# Altium schematic sheet OPTO_PRESSURE.SchDoc: Title
size A3; Date: *******; ApprovedBy: *******; CheckedBy: None; Author: *******; CompanyName: *******; DrawnBy: Name; Engineer: *******; Organization: *******; Address1: *******; Address2: *******; Address3: *******; Address4: *******; DocumentNumber: Doc Num; Revision: *******; SheetNumber: 1; SheetTotal: *******; CurrentTime: *******; CurrentDate: *******; Time: *******; DocumentFullPathAndName: *******; DocumentName: *******; ModifiedDate: *******; ImagePath: *******; ProjectName: *******; Application_BuildNumber: *******
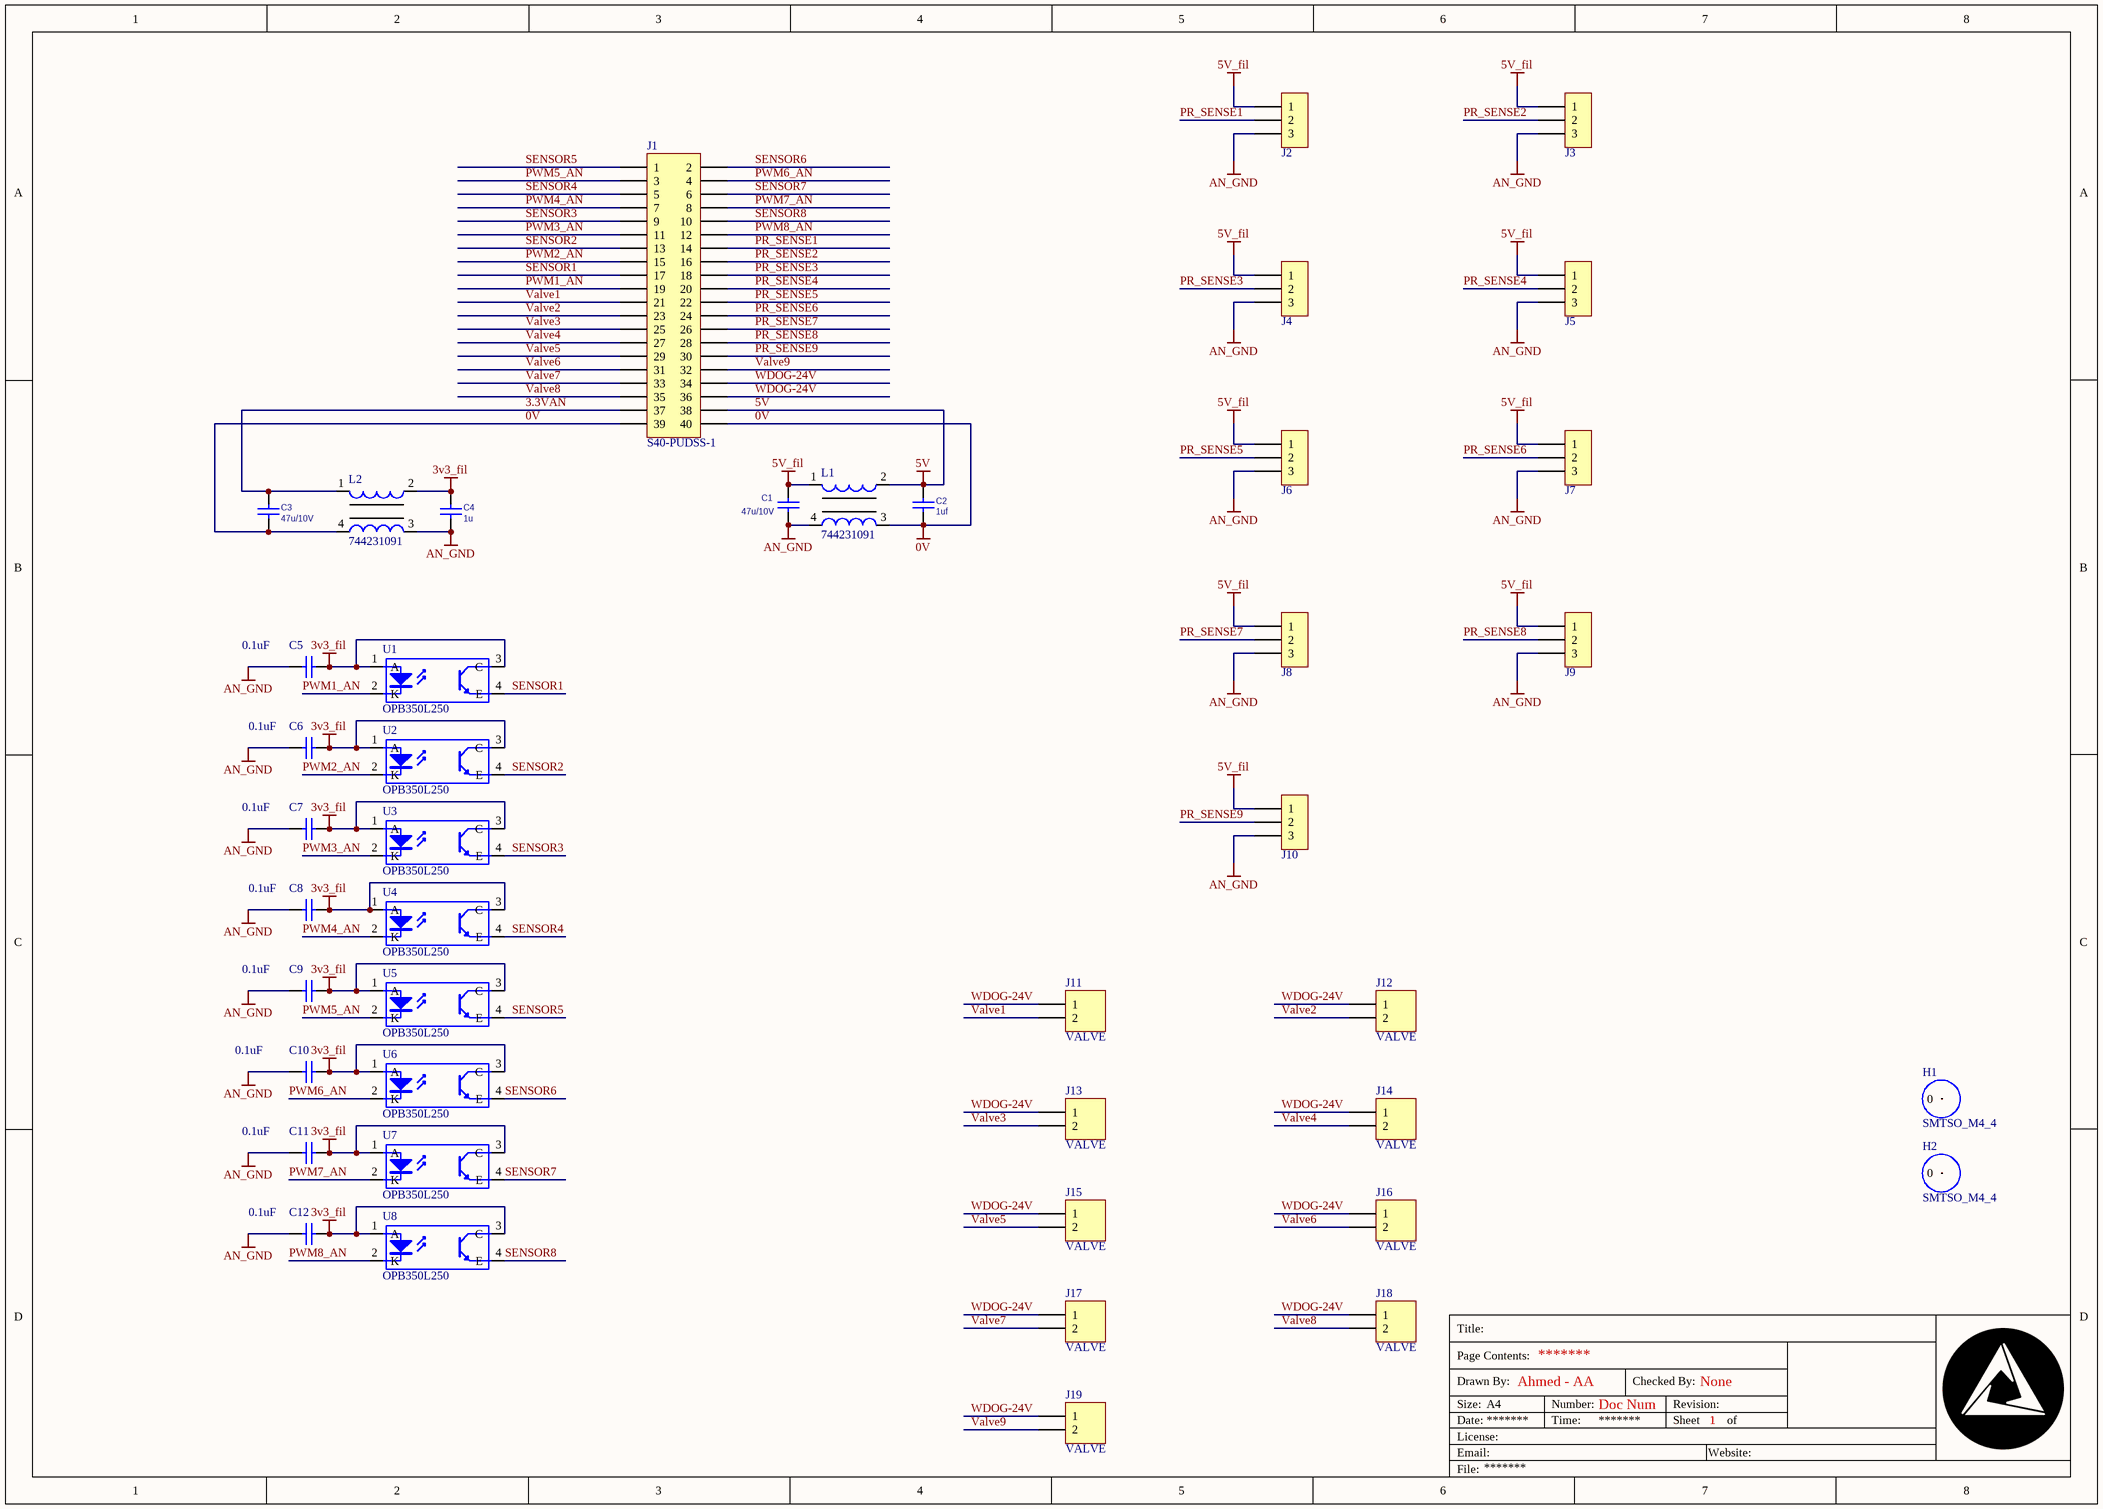
[diagram p0: OPTO_PRESSURE.SchDoc]

## Parts
C1  47u/10V  [CAPC2012X13N(0805)]
C2  1uf  [CAPC1608X09N(0603)]
C3  47u/10V  [CAPC2012X13N(0805)]
C4  1u  [CAPC1608X09N(0603)]
C5  value 0.1uF  [1608[0603]]  (hidden comment: Cap Semi)
C6  value 0.1uF  [1608[0603]]  (hidden comment: Cap Semi)
C7  value 0.1uF  [1608[0603]]  (hidden comment: Cap Semi)
C8  value 0.1uF  [1608[0603]]  (hidden comment: Cap Semi)
C9  value 0.1uF  [1608[0603]]  (hidden comment: Cap Semi)
C10  value 0.1uF  [1608[0603]]  (hidden comment: Cap Semi)
C11  value 0.1uF  [1608[0603]]  (hidden comment: Cap Semi)
C12  value 0.1uF  [1608[0603]]  (hidden comment: Cap Semi)
H1  SMTSO_M4_4  [SMTSO_M4_4]
H2  SMTSO_M4_4  [SMTSO_M4_4]
J1  S40-PUDSS-1  [S40B-PUDSS-1]
J2  CON3  [XA3]  (value not drawn)
J3  CON3  [XA3]  (value not drawn)
J4  CON3  [XA3]  (value not drawn)
J5  CON3  [XA3]  (value not drawn)
J6  CON3  [XA3]  (value not drawn)
J7  CON3  [XA3]  (value not drawn)
J8  CON3  [XA3]  (value not drawn)
J9  CON3  [XA3]  (value not drawn)
J10  CON3  [XA3]  (value not drawn)
J11  VALVE  [XA2]
J12  VALVE  [XA2]
J13  VALVE  [XA2]
J14  VALVE  [XA2]
J15  VALVE  [XA2]
J16  VALVE  [XA2]
J17  VALVE  [XA2]
J18  VALVE  [XA2]
J19  VALVE  [XA2]
L1  744231091  [WE-CNSW-0805]
L2  744231091  [WE-CNSW-0805]
U1  OPB350L250  [OPB350L250]
U2  OPB350L250  [OPB350L250]
U3  OPB350L250  [OPB350L250]
U4  OPB350L250  [OPB350L250]
U5  OPB350L250  [OPB350L250]
U6  OPB350L250  [OPB350L250]
U7  OPB350L250  [OPB350L250]
U8  OPB350L250  [OPB350L250]

## Nets
0V: C2.1 C3.1 J1.39 J1.40 L1.3 L2.4
3v3_fil: C4.2 C5.1 C6.1 C7.1 C8.1 C9.1 C10.1 C11.1 C12.1 L2.2 U1.1(A) U1.3(C) U2.1(A) U2.3(C) U3.1(A) U3.3(C) U4.1(A) U4.3(C) U5.1(A) U5.3(C) U6.1(A) U6.3(C) U7.1(A) U7.3(C) U8.1(A) U8.3(C)
5V: C2.2 J1.38 L1.2
5V_fil: C1.2 J2.1 J3.1 J4.1 J5.1 J6.1 J7.1 J8.1 J9.1 J10.1 L1.1
AN_GND: C1.1 C4.1 C5.2 C6.2 C7.2 C8.2 C9.2 C10.2 C11.2 C12.2 J2.3 J3.3 J4.3 J5.3 J6.3 J7.3 J8.3 J9.3 J10.3 L1.4 L2.3
3.3VAN: C3.2 J1.37 L2.1
PR_SENSE1: J1.14 J2.2
PR_SENSE2: J1.16 J3.2
PR_SENSE3: J1.18 J4.2
PR_SENSE4: J1.20 J5.2
PR_SENSE5: J1.22 J6.2
PR_SENSE6: J1.24 J7.2
PR_SENSE7: J1.26 J8.2
PR_SENSE8: J1.28 J9.2
PR_SENSE9: J1.30 J10.2
PWM1_AN: J1.19 U1.2(K)
PWM2_AN: J1.15 U2.2(K)
PWM3_AN: J1.11 U3.2(K)
PWM4_AN: J1.7 U4.2(K)
PWM5_AN: J1.3 U5.2(K)
PWM6_AN: J1.4 U6.2(K)
PWM7_AN: J1.8 U7.2(K)
PWM8_AN: J1.12 U8.2(K)
SENSOR1: J1.17 U1.4(E)
SENSOR2: J1.13 U2.4(E)
SENSOR3: J1.9 U3.4(E)
SENSOR4: J1.5 U4.4(E)
SENSOR5: J1.1 U5.4(E)
SENSOR6: J1.2 U6.4(E)
SENSOR7: J1.6 U7.4(E)
SENSOR8: J1.10 U8.4(E)
Valve1: J1.21 J11.2
Valve2: J1.23 J12.2
Valve3: J1.25 J13.2
Valve4: J1.27 J14.2
Valve5: J1.29 J15.2
Valve6: J1.31 J16.2
Valve7: J1.33 J17.2
Valve8: J1.35 J18.2
Valve9: J1.32 J19.2
WDOG-24V: J1.34 J1.36 J11.1 J12.1 J13.1 J14.1 J15.1 J16.1 J17.1 J18.1 J19.1

Not connected (* = marked no-connect by the designer): H1 ?1(0); H2 ?1(0)

## Notes on the sheet
- Title:
- Drawn By:
- Page Contents:
- Ahmed - AA
- Checked By:
- Size:
- Date:
- File:
- License:
- Email:
- A4
- Number:
- Time:
- Revision:
- Sheet
- Website:
- of

## Library data of the parts
C1 C3 = C2012X5R1A476M125AC: Capacitor, Ceramic, 10V, ±20%, X5R, -55°C to 85°C; 08 Manufacturer: TDK; 04 Value: 47u; 06 Package: 0805; 05 Footprint Type: SMD; 02 Part Number: C2012X5R1A476M125AC; 03 Description: Capacitor, Ceramic, 10V, ±20%, X5R, -55°C to 85°C; 01 Part Category: Capacitor; 09 Digikey PN: 445-8239-2-ND; ComponentLink1Description: Datasheet; ComponentLink1URL: L:\Datasheet\Capacitor\mlcc_commercial_general_en.pdf
C2 = GRM188R71E105KA12D: Capacitor, Ceramic, 25V, ±10%, X7R, -55°C to 125°C; 08 Manufacturer: Murata Electronics North America; 04 Value: 1u; 06 Package: 0603; 12 Author: D.Grace; 05 Footprint Type: SMD; 02 Part Number: GRM188R71E105KA12D; 03 Description: Capacitor, Ceramic, 25V, ±10%, X7R, -55°C to 125°C; 01 Part Category: Capacitor; 09 Digikey PN: 490-5307-2-ND; ComponentLink1Description: Datasheet; ComponentLink1URL: L:\Datasheet\Capacitor\c02e.pdf
C4 = GRM188R71E105KA12D: Capacitor, Ceramic, 25V, ±10%, X7R, -55°C to 125°C; 08 Manufacturer: Murata Electronics North America; 06 Package: 0603; 12 Author: D.Grace; 05 Footprint Type: SMD; 02 Part Number: GRM188R71E105KA12D; 03 Description: Capacitor, Ceramic, 25V, ±10%, X7R, -55°C to 125°C; 04 Value: 1u; 01 Part Category: Capacitor; 09 Digikey PN: 490-5307-2-ND; ComponentLink1Description: Datasheet; ComponentLink1URL: L:\Datasheet\Capacitor\c02e.pdf
C5-C12 = Cap Semi: Capacitor (Semiconductor SIM Model); Published: 8-Jun-2000; LatestRevisionDate: 29-May-2009; LatestRevisionNote: IPC-7351 Footprint Added.; Publisher: Altium Limited; PackageDescription: Chip Capacitor
  C5 C7-C12: PackageReference: C1206
  C6: PackageReference: C0805
H1 H2 = SMD standoff: SMD Standoff M4_4mm
J1 = Header 20X2: Header, 20-Pin, Dual row; LatestRevisionDate: 17-Jul-2002; LatestRevisionNote: Re-released for DXP Platform.; Publisher: Altium Limited
J2-J10 = CON3: CON; Part: Boxed Pin Header 3x1 2.5mm; MFR 1: JST; MFR 1 PN: B03B-XASK-1(LF)(SN); Supplier 1: DigiKey; Supplier 1 PN: 455-1990-ND
J11-J19 = Header 2: Header, 2-Pin; LatestRevisionDate: 17-Jul-2002; LatestRevisionNote: Re-released for DXP Platform.; Publisher: Altium Limited
L1 L2 = CMP-0222-00046-1: SMD Common Mode Noise Suppressor WE-CNSW, Z = 90 Ohm; Impedance: 90 Ohm; PackageReference: WE-CNSW-0805; DatasheetVersion: ver 4, Nov-2010; ComponentLink1URL: http://www.we-online.com; ComponentLink1Description: Manufacturer Link; PackageDescription: SMD Inductor, 4-Leads, Body 1.4 x 2.2 mm; ComponentLink2Description: Datasheet; ComponentLink2URL: http://www.we-online.de/katalog/media/pdf/744231091.pdf; PackageVersion: 2010
U1-U8 = Optoisolator1: 4-Pin Phototransistor Optocoupler; Published: 24-Mar-1999; LatestRevisionDate: 04-Mar-2005; LatestRevisionNote: Sch pins 3 & 4 Swapped.; DatasheetVersion: Nov-2003; PackageReference: DIP-4; Publisher: Altium Limited